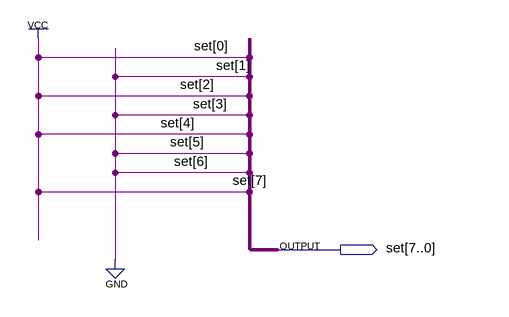
[diagram p0: schematic sheet]
// Quartus schematic num_8b_149d.bdf as structural Verilog: 0 symbols, 1 pins
module num_8b_149d (
  output [7:0] set
);


  assign set = 8'b10010101;
endmodule
